# Altium schematic sheet CPLD.SchDoc: CPLD
size A4; Author: Andreas Rehn; CompanyName: Hochschule Ulm; DrawnBy: Andreas Rehn; Engineer: Andreas Rehn; Organization: Hochschule Ulm; Address1: Institut für Medizintechnik; Address2: und Mechatronik; Address3: Albert-Einstein-Allee 55; Address4: 89081 Ulm; SheetNumber: 11; SheetTotal: 11
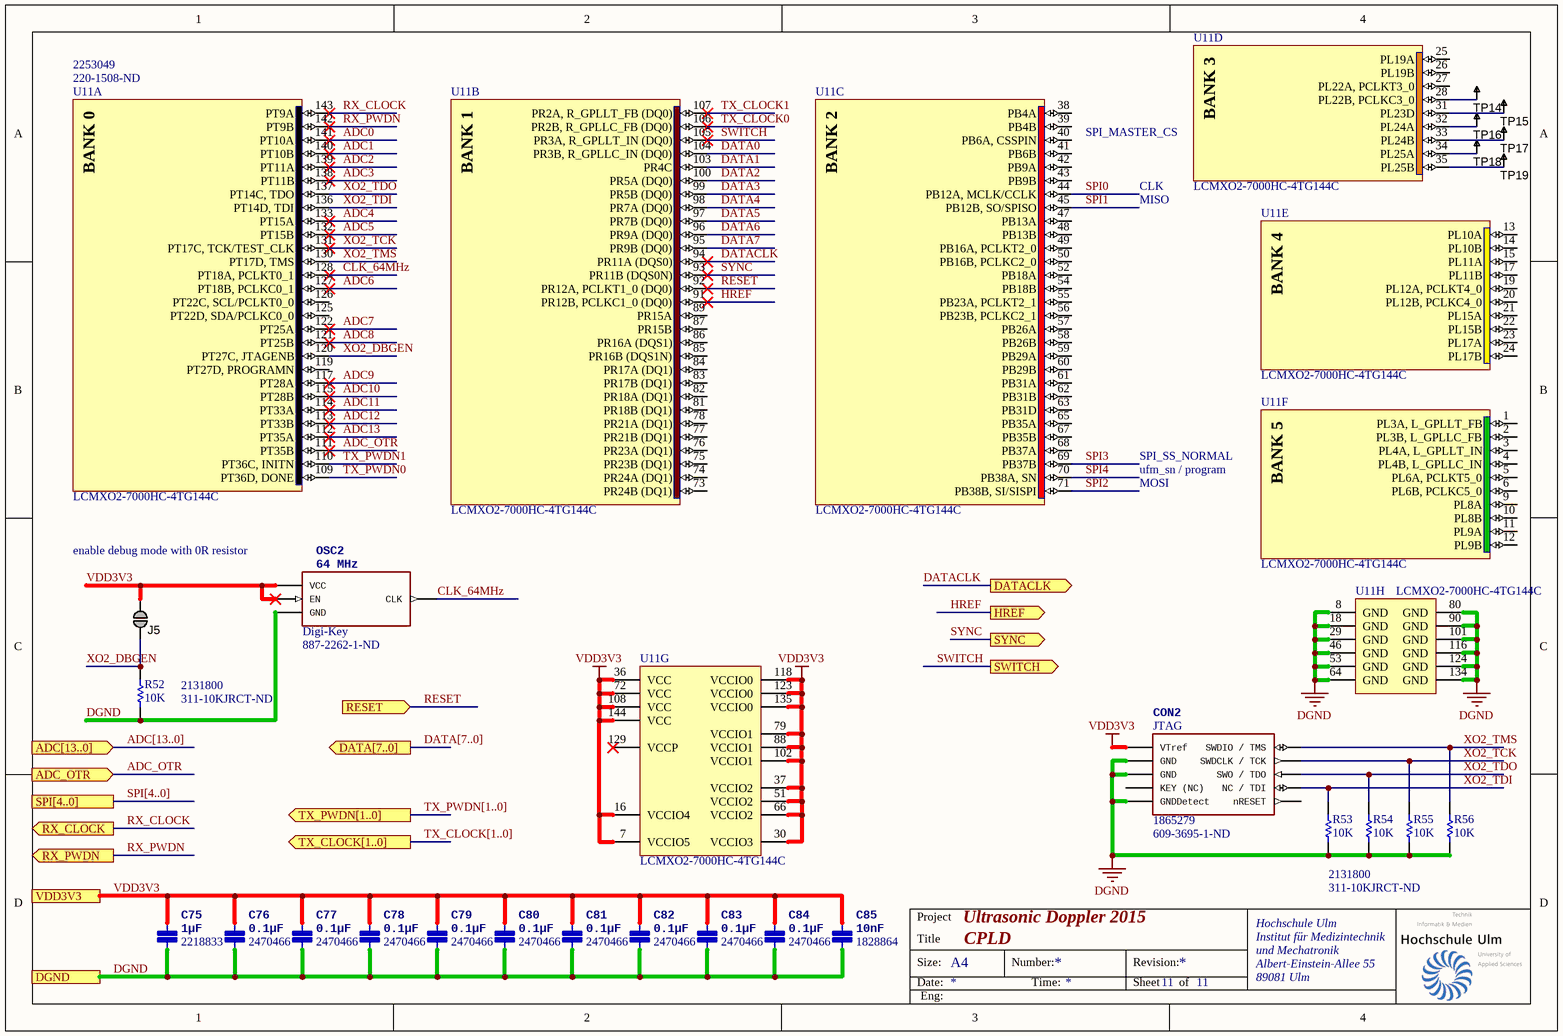
[diagram p0: CPLD.SchDoc]

## Parts
C75  1µF  Supplier Part Number 1: 2218833  [0402[1005]]
C76  0.1µF  Supplier Part Number 1: 2470466  [0402[1005]]
C77  0.1µF  Supplier Part Number 1: 2470466  [0402[1005]]
C78  0.1µF  Supplier Part Number 1: 2470466  [0402[1005]]
C79  0.1µF  Supplier Part Number 1: 2470466  [0402[1005]]
C80  0.1µF  Supplier Part Number 1: 2470466  [0402[1005]]
C81  0.1µF  Supplier Part Number 1: 2470466  [0402[1005]]
C82  0.1µF  Supplier Part Number 1: 2470466  [0402[1005]]
C83  0.1µF  Supplier Part Number 1: 2470466  [0402[1005]]
C84  0.1µF  Supplier Part Number 1: 2470466  [0402[1005]]
C85  10nF  Supplier Part Number 1: 1828864  [0402[1005]]
CON2  JTAG  Supplier Part Number 1: 609-3695-1-ND  Supplier Part Number 2: 1865279  [SWD-10-SMD]
J5  Jumper  [JUMP1]  (value not drawn)  (no BOM)
OSC2  64 MHz  Supplier 1: Digi-Key  Supplier Part Number 1: 887-2262-1-ND  [3.2X.2.5]
R52  10K  Supplier Part Number 1: 311-10KJRCT-ND  Supplier Part Number 2: 2131800  [0402[1005]]
R53  10K  Supplier Part Number 1: 311-10KJRCT-ND  Supplier Part Number 2: 2131800  [0402[1005]]
R54  10K  [0402[1005]]
R55  10K  [0402[1005]]
R56  10K  [0402[1005]]
TP14  TESTPOINT_THT_MINI  [TP-THT-MINI]  (value not drawn)
TP15  TESTPOINT_THT_MINI  [TP-THT-MINI]  (value not drawn)
TP16  TESTPOINT_THT_MINI  [TP-THT-MINI]  (value not drawn)
TP17  TESTPOINT_THT_MINI  [TP-THT-MINI]  (value not drawn)
TP18  TESTPOINT_THT_MINI  [TP-THT-MINI]  (value not drawn)
TP19  TESTPOINT_THT_MINI  [TP-THT-MINI]  (value not drawn)
U11  LCMXO2-7000HC-4TG144C  Supplier Part Number 1: 220-1508-ND  Supplier Part Number 2: 2253049  [TQFP144_N]  (parts A,B,C,D,E,F,G,H of 8)

## Ports
ADC[13..0] (in), ADC_OTR (in), DATA[7..0] (out), DATACLK (out), DGND, HREF (out), RESET (in), RX_CLOCK (out), RX_PWDN (out), SPI[4..0], SWITCH (out), SYNC (out), TX_CLOCK[1..0] (out), TX_PWDN[1..0] (out), VDD3V3

## Nets
DGND: C75.2(P$2) C76.2(P$2) C77.2(P$2) C78.2(P$2) C79.2(P$2) C80.2(P$2) C81.2(P$2) C82.2(P$2) C83.2(P$2) C84.2(P$2) C85.2(P$2) CON2.GND CON2.GNDDetect OSC2.GND R52.1 R53.2 R54.2 R55.2 R56.2 U11.8(GND) U11.18(GND) U11.29(GND) U11.46(GND) U11.53(GND) U11.64(GND) U11.80(GND) U11.90(GND) U11.101(GND) U11.116(GND) U11.124(GND) U11.134(GND) ; port DGND
VDD3V3: C75.1(P$1) C76.1(P$1) C77.1(P$1) C78.1(P$1) C79.1(P$1) C80.1(P$1) C81.1(P$1) C82.1(P$1) C83.1(P$1) C84.1(P$1) C85.1(P$1) CON2.VTref J5.1 OSC2.EN OSC2.VCC U11.7(VCCIO5) U11.16(VCCIO4) U11.30(VCCIO3) U11.36(VCC) U11.37(VCCIO2) U11.51(VCCIO2) U11.66(VCCIO2) U11.72(VCC) U11.79(VCCIO1) U11.88(VCCIO1) U11.102(VCCIO1) U11.108(VCC) U11.118(VCCIO0) U11.123(VCCIO0) U11.135(VCCIO0) U11.144(VCC) ; port VDD3V3
ADC0: U11.141(PT10A)
ADC1: U11.140(PT10B)
ADC2: U11.139(PT11A)
ADC3: U11.138(PT11B)
ADC4: U11.133(PT15A)
ADC5: U11.132(PT15B)
ADC6: U11.127(PT18B,_PCLKC0_1)
ADC7: U11.122(PT25A)
ADC8: U11.121(PT25B)
ADC9: U11.117(PT28A)
ADC10: U11.115(PT28B)
ADC11: U11.114(PT33A)
ADC12: U11.113(PT33B)
ADC13: U11.112(PT35A)
ADC_OTR: U11.111(PT35B) ; port ADC_OTR
CLK_64MHz: OSC2.CLK U11.128(PT18A,_PCLKT0_1)
DATA0: U11.104(PR3B,_R_GPLLC_IN_(DQ0))
DATA1: U11.103(PR4C)
DATA2: U11.100(PR5A_(DQ0))
DATA3: U11.99(PR5B_(DQ0))
DATA4: U11.98(PR7A_(DQ0))
DATA5: U11.97(PR7B_(DQ0))
DATA6: U11.96(PR9A_(DQ0))
DATA7: U11.95(PR9B_(DQ0))
DATACLK: U11.94(PR11A_(DQS0)) ; port DATACLK
HREF: U11.91(PR12B,_PCLKC1_0_(DQ0)) ; port HREF
RESET: U11.92(PR12A,_PCLKT1_0_(DQ0)) ; port RESET
RX_CLOCK: U11.143(PT9A) ; port RX_CLOCK
RX_PWDN: U11.142(PT9B) ; port RX_PWDN
SPI0: U11.44(PB12A,_MCLK/CCLK)
SPI1: U11.45(PB12B,_SO/SPISO)
SPI2: U11.71(PB38B,_SI/SISPI)
SPI3: U11.69(PB37B)
SPI4: U11.70(PB38A,_SN)
SWITCH: U11.105(PR3A,_R_GPLLT_IN_(DQ0)) ; port SWITCH
SYNC: U11.93(PR11B_(DQS0N)) ; port SYNC
TX_CLOCK0: U11.106(PR2B,_R_GPLLC_FB_(DQ0))
TX_CLOCK1: U11.107(PR2A,_R_GPLLT_FB_(DQ0))
TX_PWDN0: U11.109(PT36D,_DONE)
TX_PWDN1: U11.110(PT36C,_INITN)
XO2_DBGEN: J5.2 R52.2 U11.120(PT27C,_JTAGENB)
XO2_TCK: CON2.TCK(SWDCLK_/_TCK) R55.1 U11.131(PT17C,_TCK/TEST_CLK)
XO2_TDI: CON2.TDI(NC_/_TDI) R53.1 U11.136(PT14D,_TDI)
XO2_TDO: CON2.TDO(SWO_/_TDO) R54.1 U11.137(PT14C,_TDO)
XO2_TMS: CON2.TMS(SWDIO_/_TMS) R56.1 U11.130(PT17D,_TMS)
NetTP14_1: TP14.1 U11.28(PL22B,_PCLKC3_0)
NetTP15_1: TP15.1 U11.31(PL23D)
NetTP16_1: TP16.1 U11.32(PL24A)
NetTP17_1: TP17.1 U11.33(PL24B)
NetTP18_1: TP18.1 U11.34(PL25A)
NetTP19_1: TP19.1 U11.35(PL25B)

Not connected (* = marked no-connect by the designer): CON2 KEY(KEY_(NC)) nRESET; U11 1(PL3A,_L_GPLLT_FB) 2(PL3B,_L_GPLLC_FB) 3(PL4A,_L_GPLLT_IN) 4(PL4B,_L_GPLLC_IN) 5(PL6A,_PCLKT5_0) 6(PL6B,_PCLKC5_0) 9(PL8A) 10(PL8B) 11(PL9A) 12(PL9B) 13(PL10A) 14(PL10B) 15(PL11A) 17(PL11B) 19(PL12A,_PCLKT4_0) 20(PL12B,_PCLKC4_0) 21(PL15A) 22(PL15B) 23(PL17A) 24(PL17B) 25(PL19A) 26(PL19B) 27(PL22A,_PCLKT3_0) 38(PB4A) 39(PB4B) 40(PB6A,_CSSPIN) 41(PB6B) 42(PB9A) 43(PB9B) 47(PB13A) 48(PB13B) 49(PB16A,_PCLKT2_0) 50(PB16B,_PCLKC2_0) 52(PB18A) 54(PB18B) 55(PB23A,_PCLKT2_1) 56(PB23B,_PCLKC2_1) 57(PB26A) 58(PB26B) 59(PB29A) 60(PB29B) 61(PB31A) 62(PB31B) 63(PB31D) 65(PB35A) 67(PB35B) 68(PB37A) 73(PR24B_(DQ1)) 74(PR24A_(DQ1)) 75(PR23B_(DQ1)) 76(PR23A_(DQ1)) 77(PR21B_(DQ1)) 78(PR21A_(DQ1)) 81(PR18B_(DQ1)) 82(PR18A_(DQ1)) 83(PR17B_(DQ1)) 84(PR17A_(DQ1)) 85(PR16B_(DQS1N)) 86(PR16A_(DQS1)) 87(PR15B) 89(PR15A) 119(PT27D,_PROGRAMN) 125(PT22D,_SDA/PCLKC0_0) 126(PT22C,_SCL/PCLKT0_0) 129(VCCP)*

## Buses and harness runs
bus ADC[13..0] = port ADC[13..0]
bus DATA[7..0] = port DATA[7..0]
bus SPI[4..0] = port SPI[4..0]
bus TX_CLOCK[1..0] = port TX_CLOCK[1..0]
bus TX_PWDN[1..0] = port TX_PWDN[1..0]

## Notes on the sheet
- (near U11) SPI_MASTER_CS
- CLK
- MISO
- MOSI
- ufm_sn / program
- SPI_SS_NORMAL
- enable debug mode with 0R resistor
- Project
- Ultrasonic Doppler 2015
- Title
- Size:
- Date:
- A4
- Number:
- Time:
- Revision:
- Sheet
- of
- Eng:
- (in symbol CMP-0111-00318-1, part A) BANK 0
- (in symbol CMP-0111-00318-1, part B) BANK 1
- (in symbol CMP-0111-00318-1, part C) BANK 2
- (in symbol CMP-0111-00318-1, part D) BANK 3
- (in symbol CMP-0111-00318-1, part E) BANK 4
- (in symbol CMP-0111-00318-1, part F) BANK 5

## Library data of the parts
C75-C85 = Capacitor: Cap; Supplier 1: Farnell
  C75: value: 1µF
  C76-C84: value: 0.1µF
  C85: value: 10nF
CON2 = SWD-10_SMD: Supplier 1: Digi-Key; Supplier 2: Farnell
J5 = JUMP1: SMD jumper
OSC2 = Crystal 4PIN: Oszilator; value: 64 MHz
R52-R56 = Resistor: Published: 8-Jun-2000; LatestRevisionDate: 17-Jul-2002; LatestRevisionNote: Re-released for DXP Platform.; PackageReference: AXIAL-0.3; Publisher: Altium Limited; PackageDescription: Axial Device, Thru-Hole; 2 Leads; 0.3 in Pin Spacing; Value: 10K; Supplier 1: Digi-Key; Supplier 2: Farnell
  R54-R56: Supplier Part Number 1: 311-10KJRCT-ND; Supplier Part Number 2: 2131800
TP14-TP19 = TESTPOINT_THT_MINI: Test Point PCB mount Miniature White; PBL Part Number: 3100-567; Manufacturer 1: Keystone Electronics; Manufacturer Part Number 1: 5002; Mounting Type: 0.040" (1.0mm) Hole Diameter; Material: Base, Nylon 46, UL 94V-0; Supplier 1: Digi-Key; Supplier Part Number 1: 5002K-ND
U11 = CMP-0111-00318-1: MachXO2 High Performance CPLD with 6864 LUTs, Voltage Regulator, 2.5V/3.3V, 144-pin TQFP, Speed Grade-4, Commercial Grade, Halogen Free (RoHS); PackageVersion: ver02.6, Nov-2010; DatasheetVersion: ver01.0, Nov-2010; Code_JEDEC: MS-026-BFB; PackageDescription: 144-Pin Thin Quad Flat Pack (TQFP144); PackageReference: TQFP144; PartId: 1; Supplier 1: Digi-Key; Supplier 2: Farnell